# EAGLE design watch_1.2 (EAGLE 9.6.2)
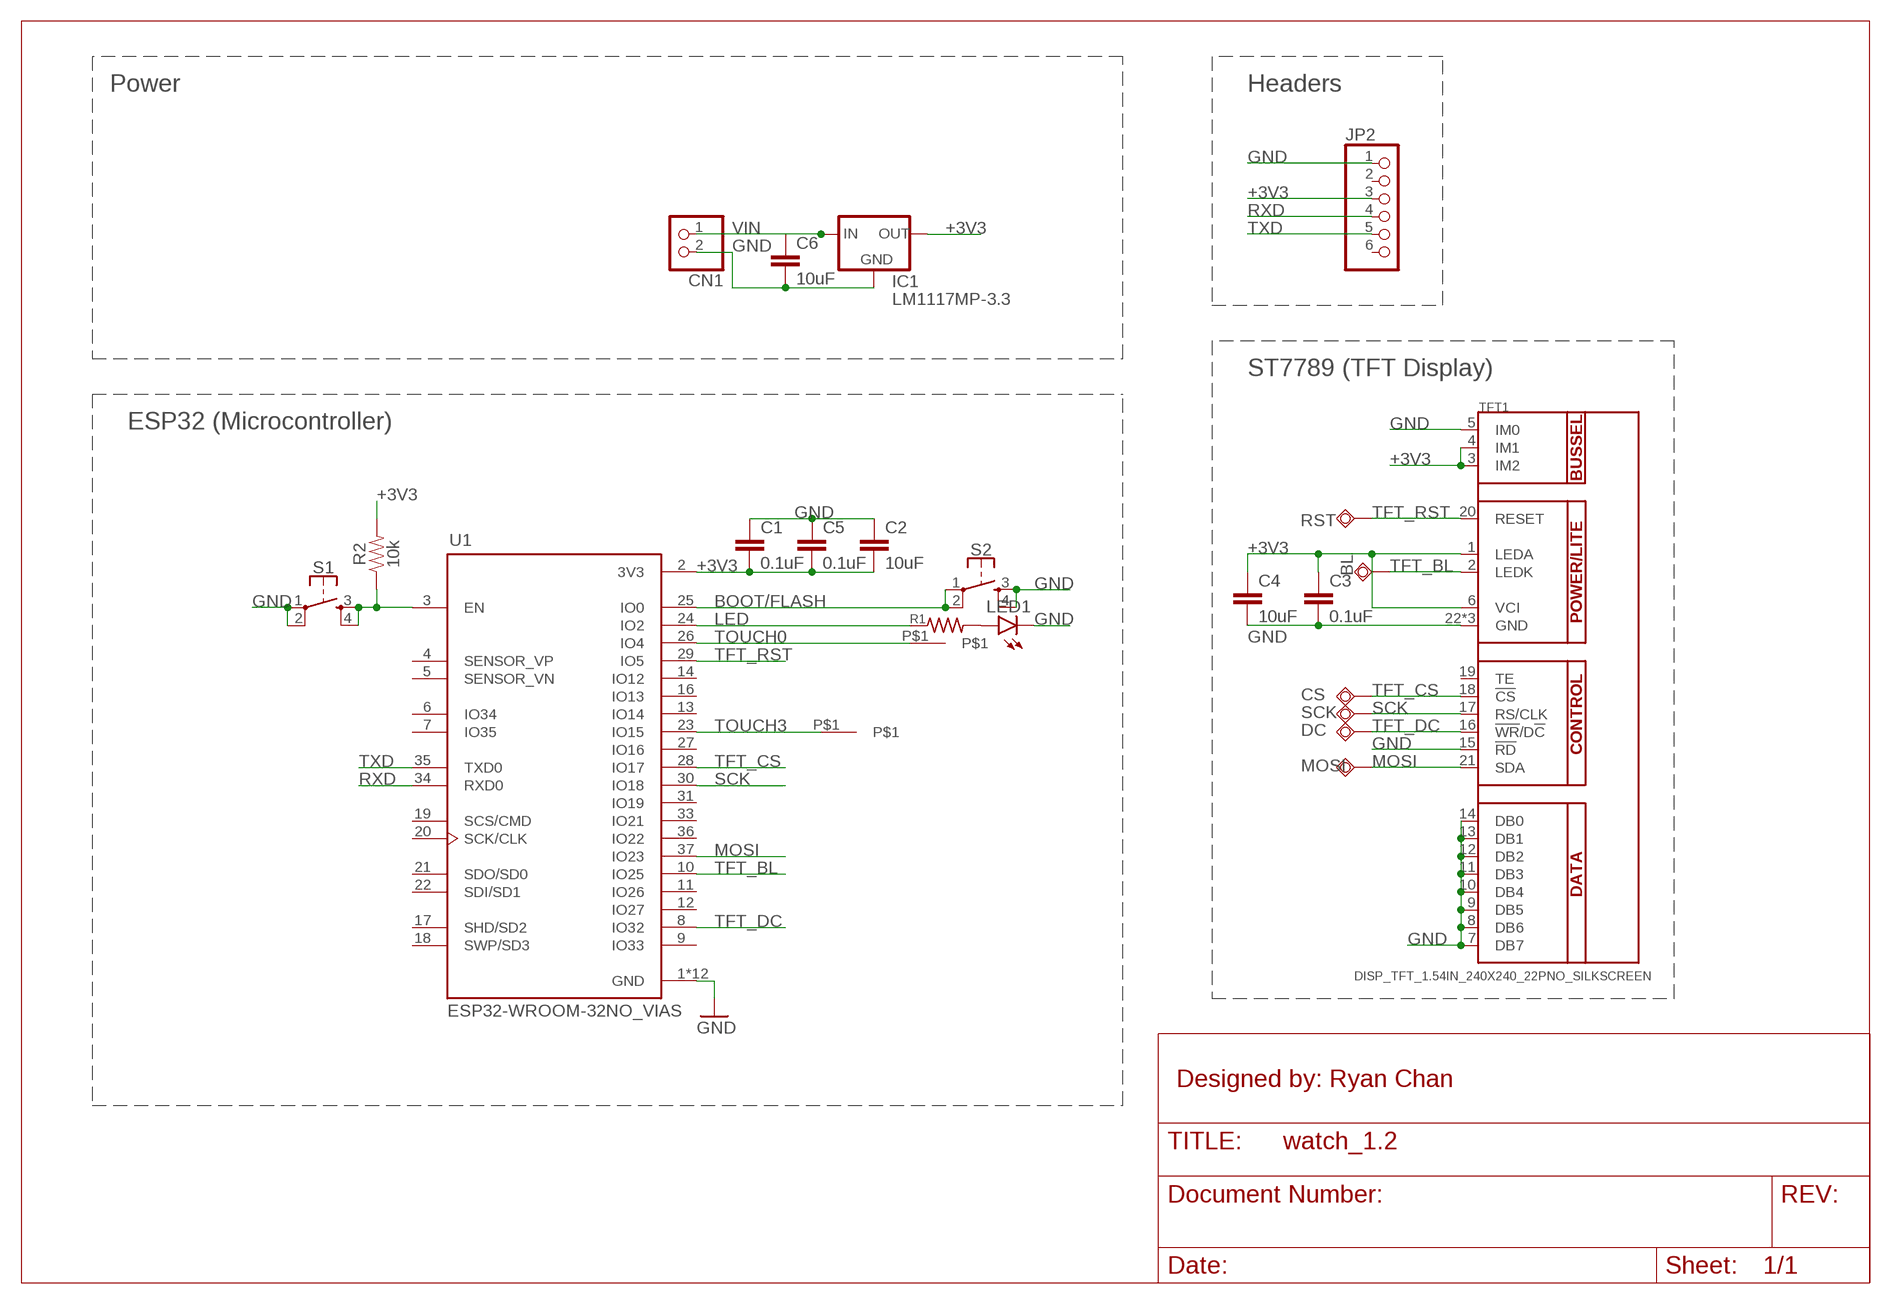
[diagram p0: schematic, sheet 1]

## Parts
BL  TPSQTP20R  [TP20R]
C1  0.1uF  C-EUC0603  [C0603]
C2  10uF  C-EUC0603  [C0603]
C3  0.1uF  C-EUC0603  [C0603]
C4  10uF  C-EUC0603  [C0603]
C5  0.1uF  C-EUC0603  [C0603]
C6  10uF  C-EUC0603  [C0603]
CN1  JST_2PIN-SMT-RA  [JST-PH-2-SMT-RA]
CS  TPSQTP20R  [TP20R]
DC  TPSQTP20R  [TP20R]
IC1  LM1117MP-3.3  [SOT223]
JP2  PINHD-1X6CLEAN  [1X06-CLEAN]
LED1  LEDCHIPLED_0603  [CHIPLED_0603]
MOSI  TPSQTP20R  [TP20R]
R1  R-US_R0603  [R0603]
R2  10k  10KOHM-0603-1/10W-1%  [0603]
RST  TPSQTP20R  [TP20R]
S1  RESET  MOMENTARY-SWITCH-SPST-2-SMD-4.6X2.8MM  [TACTILE_SWITCH_SMD_4.6X2.8MM]
S2  RESET  MOMENTARY-SWITCH-SPST-2-SMD-4.6X2.8MM  [TACTILE_SWITCH_SMD_4.6X2.8MM]
SCK  TPSQTP20R  [TP20R]
TFT1  DISP_TFT_1.54IN_240X240_22PNO_SILKSCREEN  [TFT_1.54IN_240X240_22PIN_NO_SILKSCREEN]
U1  ESP32-WROOM-32NO_VIAS  [MODULE_ESP32-WROOM-32_NO_VIAS]
U$1  CAPACITIVE_PAD_1  [CAPACITIVE_PAD_1]
U$2  CAPACITIVE_PAD_1  [CAPACITIVE_PAD_1]

## Nets
+3V3: C1.2 C2.2 C3.1 C4.1 C5.2 IC1.2(OUT) IC1.4(OUT) JP2.3 R2.2 TFT1.1(LEDA) TFT1.3(IM2) TFT1.4(IM1) TFT1.6(VCI) U1.2(3V3)
BOOT/FLASH: S2.1 S2.2 U1.25(IO0)
CHIP_PU: R2.1 S1.3 S1.4 U1.3(EN)
GND: C1.1 C2.1 C3.2 C4.2 C5.1 C6.2 CN1.2 IC1.1(GND) JP2.1 LED1.C S1.1 S1.2 S2.3 S2.4 TFT1.5(IM0) TFT1.7(DB7) TFT1.8(DB6) TFT1.9(DB5) TFT1.10(DB4) TFT1.11(DB3) TFT1.12(DB2) TFT1.13(DB1) TFT1.14(DB0) TFT1.15(!RD) TFT1.22(GND) TFT1.SUPPORT1(GND) TFT1.SUPPORT2(GND) U1.1(GND) U1.15(GND) U1.38(GND) U1.39_1(GND) U1.39_2(GND) U1.39_3(GND) U1.39_4(GND) U1.39_5(GND) U1.39_6(GND) U1.39_7(GND) U1.39_8(GND) U1.39_9(GND)
LED: R1.1 U1.24(IO2)
MOSI: MOSI.TP TFT1.21(SDA) U1.37(IO23)
N$1: LED1.A R1.2
RXD: JP2.4 U1.34(RXD0)
SCK: SCK.TP TFT1.17(RS/CLK) U1.30(IO18)
TFT_BL: BL.TP TFT1.2(LEDK) U1.10(IO25)
TFT_CS: CS.TP TFT1.18(!CS) U1.28(IO17)
TFT_DC: DC.TP TFT1.16(!WR!/D!C) U1.8(IO32)
TFT_RST: RST.TP TFT1.20(RESET) U1.29(IO5)
TOUCH0: U1.26(IO4) U$2.P$1
TOUCH3: U1.23(IO15) U$1.P$1
TXD: JP2.5 U1.35(TXD0)
VIN: C6.1 CN1.1 IC1.3(IN)
Unconnected: JP2.2 JP2.6 TFT1.19(TE) U1.4(SENSOR_VP) U1.5(SENSOR_VN) U1.6(IO34) U1.7(IO35) U1.9(IO33) U1.11(IO26) U1.12(IO27) U1.13(IO14) U1.14(IO12) U1.16(IO13) U1.17(SHD/SD2) U1.18(SWP/SD3) U1.19(SCS/CMD) U1.20(SCK/CLK) U1.21(SDO/SD0) U1.22(SDI/SD1) U1.27(IO16) U1.31(IO19) U1.33(IO21) U1.36(IO22)

## Notes on the sheet
- Power | Headers
- ST7789 (TFT Display)
- ESP32 (Microcontroller)
- Designed by: Ryan Chan

## Library data of the parts
BL CS DC MOSI RST SCK = testpad:TPSQ: Test pad
C1-C6 = rcl:C-EU: CAPACITOR, European symbol; SPICEPREFIX: C
CN1 = adafruit:JST_2PIN: JST 2-Pin Connectors of various flavors SMT-RA (S2B-PH-SM4) 4UConnector #17311 SMT (B2B-PH-SM4) THM-RA (S2B-PH) THM (B2B-PH)
IC1 = lm1117_10:LM1117?-*: 800mA Low-Dropout Linear Regulator Source: http://www.ti.com/lit/ds/symlink/lm1117-n.pdf; MF: Texas Instruments; MPN: LM1117MP-3.3; OC_FARNELL: 9778195; OC_NEWARK: 28X3416
JP2 = adafruit:PINHD-1X6: PIN HEADER
LED1 = led:LED: LED OSRAM: - CHIPLED LG R971, LG N971, LY N971, LG Q971, LY Q971, LO R971, LY R971 LH N974, LH R974 LS Q976, LO Q976, LY Q976 LO Q996 - Hyper CHIPLED LW Q18S LB Q993, LB Q99A, LB R99A - SideLED LS A670, LO A670, LY A670, LG A670, LP A670 LB A673, LV A673, LT A673, LW A673 LH A674 LY A675 LS A676, LA A676, LO A676, LY A676, LW A676 LS A679, LY A679, LG A679 - Hyper Micro SIDELED® LS Y876, LA Y876, LO Y876, LY Y876 LT Y87S - SmartLED LW L88C, LW L88S LB L89C, LB L89S, LG L890 LS L89K, LO L89K, LY L89K LS L896, LA L896, LO L896, LY L896 - TOPLED LS T670, LO T670, LY T670, LG T670, LP T670 LSG T670, LSP T670, LSY T670, LOP T670, LYG T670 LG T671, LOG T671, LSG T671 LB T673, LV T673, LT T673, LW T673 LH T674 LS T676, LA T676, LO T676, LY T676, LB T676, LH T676, LSB T676, LW T676 LB T67C, LV T67C, LT T67C, LS T67K, LO T67K, LY T67K, LW E67C LS E67B, LA E67B, LO E67B, LY E67B, LB E67C, LV E67C, LT E67C LW T67C LS T679, LY T679, LG T679 LS T770, LO T770, LY T770, LG T770, LP T770 LB T773, LV T773, LT T773, LW T773 LH T774 LS E675, LA E675, LY E675, LS T675 LS T776, LA T776, LO T776, LY T776, LB T776 LHGB T686 LT T68C, LB T68C - Hyper Mini TOPLED® LB M676 - Mini TOPLED Santana® LG M470 LS M47K, LO M47K, LY M47K Source: http://www.osram.convergy.de LUXEON: - LUMILED® LXK2-PW12-R00, LXK2-PW12-S00, LXK2-PW14-U00, LXK2-PW14-V00 LXK2-PM12-R00, LXK2-PM12-S00, LXK2-PM14-U00 LXK2-PE12-Q00, LXK2-PE12-R00, LXK2-PE12-S00, LXK2-PE14-T00, LXK2-PE14-U00 LXK2-PB12-K00, LXK2-PB12-L00, LXK2-PB12-M00, LXK2-PB14-N00, LXK2-PB14-P00, LXK2-PB14-Q00 LXK2-PR12-L00, LXK2-PR12-M00, LXK2-PR14-Q00, LXK2-PR14-R00 LXK2-PD12-Q00, LXK2-PD12-R00, LXK2-PD12-S00 LXK2-PH12-R00, LXK2-PH12-S00 LXK2-PL12-P00, LXK2-PL12-Q00, LXK2-PL12-R00 Source: www.luxeon.com KINGBRIGHT: KA-3528ASYC Source: www.kingbright.com
R1 = rcl:R-US_: RESISTOR, American symbol; SPICEPREFIX: R
R2 = SparkFun-Resistors:10KOHM: 10kΩ resistor A resistor is a passive two-terminal electrical component that implements electrical resistance as a circuit element. Resistors act to reduce current flow, and, at the same time, act to lower voltage levels within circuits. - Wikipedia; PROD_ID: RES-00824
S1 S2 = SparkFun-Switches:MOMENTARY-SWITCH-SPST-2: Momentary Switch (Pushbutton) - SPST - Two Circuits Normally-open (NO) SPST momentary switches (buttons, pushbuttons). Schematic symbol includes two switch circuits. Variants SMD-4.6MMX2.8MM - 4.60mm x 2.80mm Tactile Momentary Button Switch - Used on SparkFun SAMD21 Mini Breakout <https://www.sparkfun.com/products/13664> SMD-5.2MM - Mini Pushbutton Switch - SMD <https://www.sparkfun.com/products/8720> - Used on Arduino Pro Mini <https://www.sparkfun.com/products/11114>; PROD_ID: SWCH-13065
TFT1 = a_personal:DISP_TFT_1.54IN_240X240_22P
U1 = ESP32-WROOM-32:ESP32-WROOM-32: Bluetooth, WiFi Transceiver Module 2.4GHz ~ 2.5GHz Surface Mount Check prices <https://pricing.snapeda.com/parts/ESP32-WROOM-32/Espressif%20Systems/view-part?ref=eda>
U$1 U$2 = a_personal:CAPACITIVE_PAD_1

## Board
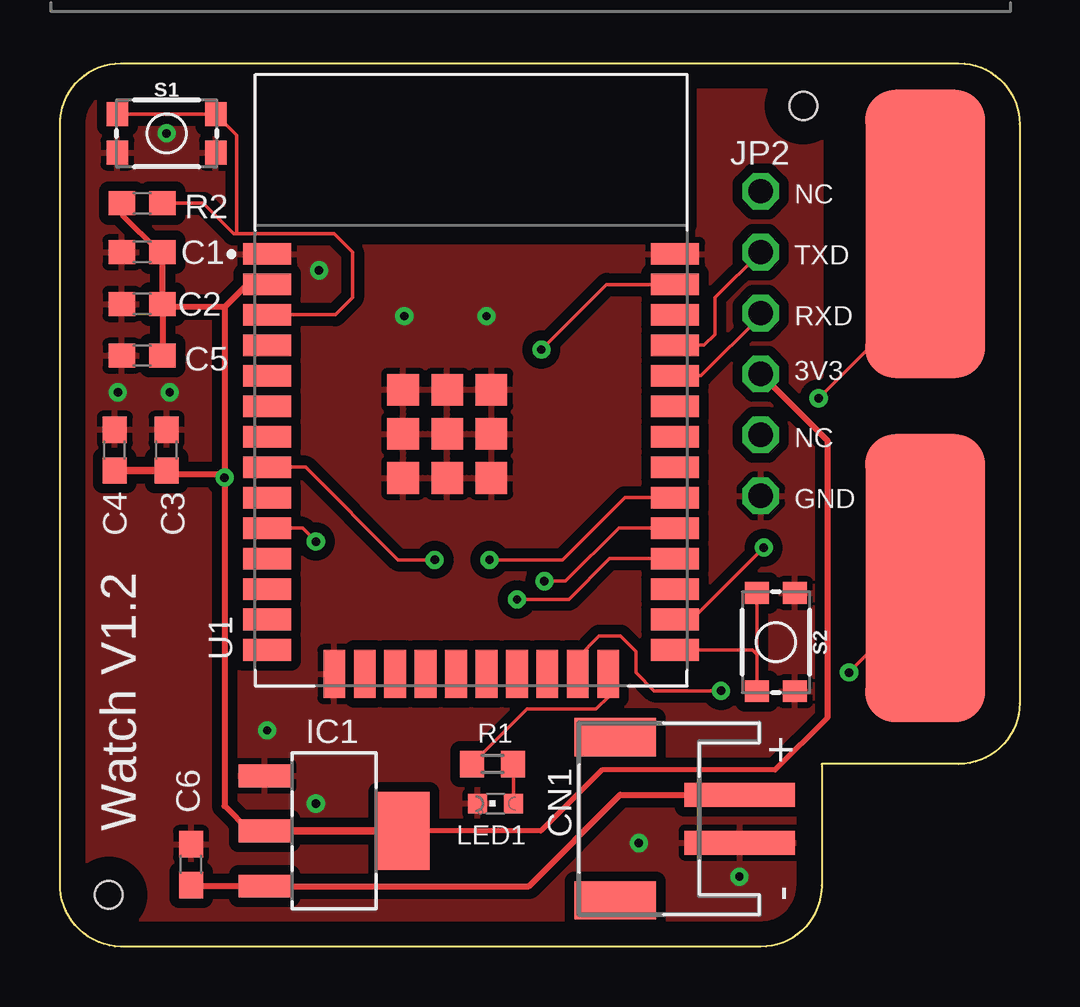
[diagram p1: board, top side]
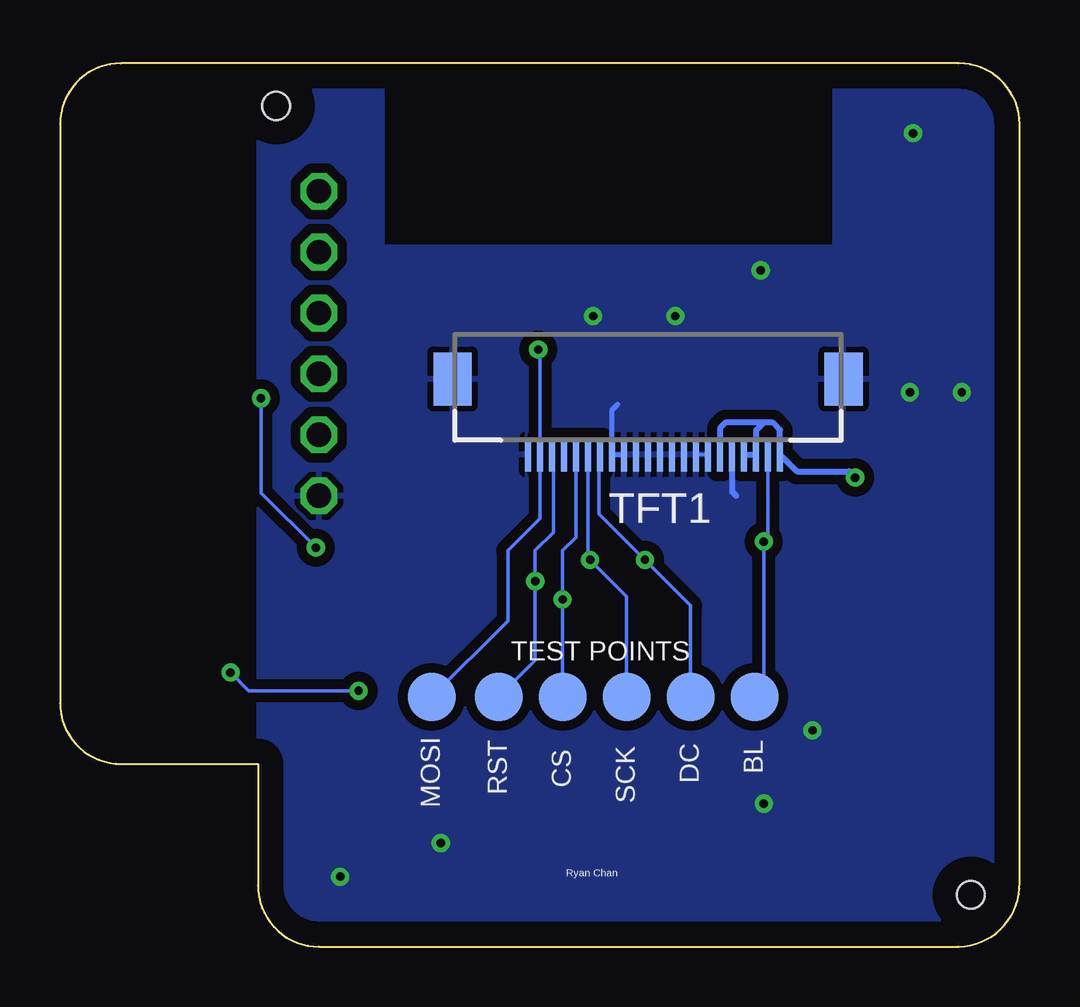
[diagram p2: board, bottom side, seen from below]

Size 40.01 x 36.83 mm. Coordinates in mm from the lower left corner, seen from the top.
Outline: 31.75,7.62 31.75,2.54 arc-90 29.21,0 2.54,0 arc-90 0,2.67 0,34.29 arc-90 2.54,36.83 37.47,36.83 arc-90 40.01,34.29 40.01,10.16 arc-90 37.47,7.62 31.75,7.62
Copper layers (1*16): Top 0.035mm / dielectric 1.5mm / Bottom 0.035mm
Design rules "default": minimum track width 6mil, minimum drill 0.35mm, track to track 6mil, track to pad 6mil, pad to pad 6mil, via to via 6mil, smd to smd 6mil, copper to edge 40mil, drill to drill 6mil, minimum pad ring 10mil, minimum via ring 8mil, stop-mask expansion 4mil, vias tented up to drill 0mil, thermal gap 10mil
Holes 1.16 mm at 2.03,2.16 30.99,35.05

### Footprints (pad centres in the part's own frame; a part is rotated, then mirrored left to right if it is on the bottom)
TP20R = smd 2 x 2: TP 0,0
C0603 = smd 1.1 x 1: 1 -0.85,0; 2 0.85,0
JST-PH-2-SMT-RA = smd 1 x 4.6: 1 1,-3.7; 2 -1,-3.7 | smd 1.6 x 3.4: NC1 -3.4,1.5; NC2 3.4,1.5
SOT223 = smd 0.95 x 2.15: 1 -2.3,-2.9; 2 0,-2.9; 3 2.3,-2.9 | smd 3.25 x 2.15: 4 0,2.9
1X06-CLEAN = drill 1.016 octagon: 1 -6.35,0; 2 -3.81,0; 3 -1.27,0; 4 1.27,0; 5 3.81,0; 6 6.35,0
CHIPLED_0603 = smd 0.8 x 0.8: A 0,-0.75; C 0,0.75
R0603 = smd 1 x 1.1: 1 -0.85,0; 2 0.85,0
0603 = smd 1.1 x 1: 1 -0.85,0; 2 0.85,0
TACTILE_SWITCH_SMD_4.6X2.8MM = smd 0.9 x 1: 1 -2.05,-0.8; 2 2.05,-0.8; 3 2.05,0.8; 4 -2.05,0.8
TFT_1.54IN_240X240_22PIN_NO_SILKSCREEN = smd 0.25 x 1.4 bottom: 1 5.25,2.722; 2 4.75,2.722; 3 4.25,2.722; 4 3.75,2.722; 5 3.25,2.722; 6 2.75,2.722; 7 2.25,2.722; 8 1.75,2.722; 9 1.25,2.722; 10 0.75,2.722; 11 0.25,2.722; 12 -0.25,2.722; 13 -0.75,2.722; 14 -1.25,2.722; 15 -1.75,2.722; 16 -2.25,2.722; 17 -2.75,2.722; 18 -3.25,2.722; 19 -3.75,2.722; 20 -4.25,2.722; 21 -4.75,2.722; 22 -5.25,2.722 | smd 1.6 x 2.2 bottom: SUPPORT1 7.9,-0.428; SUPPORT2 -8.4,-0.428
MODULE_ESP32-WROOM-32_NO_VIAS = smd 2 x 0.9: 1 -8.5,5.26; 2 -8.5,3.99; 3 -8.5,2.72; 4 -8.5,1.45; 5 -8.5,0.18; 6 -8.5,-1.09; 7 -8.5,-2.36; 8 -8.5,-3.63; 9 -8.5,-4.9; 10 -8.5,-6.17; 11 -8.5,-7.44; 12 -8.5,-8.71; 13 -8.5,-9.98; 14 -8.5,-11.25; 25 8.5,-11.25; 26 8.5,-9.98; 27 8.5,-8.71; 28 8.5,-7.44; 29 8.5,-6.17; 30 8.5,-4.9; 31 8.5,-3.63; 32 8.5,-2.36; 33 8.5,-1.09; 34 8.5,0.18; 35 8.5,1.45; 36 8.5,2.72; 37 8.5,3.99; 38 8.5,5.26 | smd 0.9 x 2: 15 -5.715,-12.25; 16 -4.445,-12.25; 17 -3.175,-12.25; 18 -1.905,-12.25; 19 -0.635,-12.25; 20 0.635,-12.25; 21 1.905,-12.25; 22 3.175,-12.25; 23 4.445,-12.25; 24 5.715,-12.25 | smd 1.33 x 1.33: 39_1 -2.835,-0.405; 39_2 -1,-0.405; 39_3 0.835,-0.405; 39_4 -2.835,-2.24; 39_5 -1,-2.24; 39_6 0.835,-2.24; 39_7 -2.835,-4.075; 39_8 -1,-4.075; 39_9 0.835,-4.075
CAPACITIVE_PAD_1 = smd 5 x 12: P$1 0,0

### Placement (x,y rotation side)
BL  11.05,10.41 0 bottom
C1  3.43,28.96 0 top
C2  3.43,26.8 0 top
C3  4.45,20.7 90 top
C4  2.29,20.7 90 top
C5  3.43,24.64 0 top
C6  5.46,3.43 90 top
CN1  24.64,5.33 90 top
CS  19.05,10.41 0 bottom
DC  13.72,10.41 0 bottom
IC1  11.43,4.83 270 top
JP2  29.21,25.15 90 top
LED1  18.16,5.97 90 top
MOSI  24.51,10.41 0 bottom
R1  18.03,7.62 0 top
R2  3.43,30.99 180 top
RST  21.72,10.41 0 bottom
S1  4.45,33.91 0 top
S2  29.84,12.7 270 top
SCK  16.38,10.41 0 bottom
TFT1  15.24,23.24 180 top
U1  17.14,23.62 0 top
U$1  36.07,15.37 0 top
U$2  36.07,29.72 0 top

### Tracks (layer width: path | path; a pad name or v marks a point on that pad's centre or on a via)
+3V3  (via drill 0.35)
  Top 0.152: C1.2 4.15,28.96 4.11,29
  Top 0.203: 32,9.56 29.81,7.37 22.59,7.37 20.05,4.83 IC1.4 | R2.2 2.58,30.53 4.11,29 4.28,28.83
  Top 0.254: v6.86,19.56 6.86,19.69 4.61,19.69 C3.1 | IC1.2 7.89,4.83 6.86,5.86 v6.86,19.56 | JP2.3 32,21.08 32,9.56 | U1.2 7.8,27.61 6.86,26.67 | 6.86,26.67 v6.86,19.56 | 6.86,26.67 4.41,26.67 C2.2 | C2.2 4.28,28.83 C1.2 | C2.2 C5.2
  Top 0.305: C3.1 C4.1 | IC1.2 IC1.4
  Bottom 0.254: TFT1.4 TFT1.3 10.99,21.52 10.67,21.84 | TFT1.6 12.49,21.62 12.27,21.84 10.67,21.84 | 10.67,21.84 10.29,21.84 9.99,21.55 TFT1.1 9.28,19.81 7.11,19.81 v6.86,19.56
BOOT/FLASH
  Top 0.152: S2.2 29.05,12.19 | 29.05,12.19 S2.1 | 29.05,12.19 28.86,12.37 U1.25
CHIP_PU
  Top 0.152: R2.1 5.97,30.99 7.24,29.72 7.37,29.72 | 7.37,29.72 7.37,33.84 S1.3 S1.4 | U1.3 11.48,26.34 12.19,27.05 12.19,28.96 11.43,29.72 7.37,29.72
GND  (via drill 0.35)
  Bottom 0.152: TFT1.7 TFT1.8
  Bottom 0.203: TFT1.14 TFT1.15 16.99,22.38 16.76,22.61
  Bottom 0.254: TFT1.5 11.99,18.98 11.81,18.8
  other vias: 17.78,26.29 14.35,26.29 2.41,23.11 8.64,9.02 4.45,33.91 4.57,23.11 24.13,4.32 10.67,5.97 10.79,28.19 28.32,2.92
  pour Top (isolate 0.406): -0.64,-2.54 -0.64,36.83 7.75,36.83 7.75,29.21 26.54,29.21 26.54,36.83 31.75,36.83 31.75,-2.54
  pour Bottom (isolate 0.406): -0.64,-2.54 -0.64,36.83 7.75,36.83 7.75,29.21 26.54,29.21 26.54,36.83 31.75,36.83 31.75,-2.54
LED
  Top 0.152: U1.24 22.86,10.41 22.35,9.91 19.47,9.91 R1.1
MOSI  (via drill 0.35)
  Top 0.152: v20.07,24.89 22.79,27.61 U1.37
  Bottom 0.152: v20.07,24.89 19.99,24.82 TFT1.21 19.99,17.86 21.34,16.51 21.34,13.59 MOSI.TP
N$1
  Top 0.152: R1.2 18.91,7.59 LED1.A
RXD
  Top 0.152: U1.34 25.91,23.8 26.6,23.8 26.72,23.8 29.21,26.29 JP2.4
SCK  (via drill 0.35)
  Top 0.152: v17.91,16.13 20.95,16.13 23.55,18.72 U1.30
  Bottom 0.152: TFT1.17 17.99,16.21 v17.91,16.13 16.38,14.61 SCK.TP
TFT_BL  (via drill 0.35)
  Top 0.152: U1.10 10.11,17.45 v10.67,16.89
  Bottom 0.152: TFT1.2 10.49,17.07 v10.67,16.89 10.67,10.8 BL.TP
TFT_CS  (via drill 0.35)
  Top 0.152: v19.05,14.48 21.21,14.48 22.91,16.18 U1.28
  Bottom 0.152: TFT1.18 18.49,17.07 19.05,16.51 v19.05,14.48 CS.TP
TFT_DC  (via drill 0.35)
  Top 0.152: v15.62,16.13 14.1,16.13 10.23,19.99 U1.8
  Bottom 0.152: TFT1.16 17.53,20.48 17.53,18.03 v15.62,16.13 13.72,14.22 DC.TP
TFT_RST  (via drill 0.35)
  Top 0.152: v20.19,15.24 21.08,15.24 23.29,17.45 U1.29
  Bottom 0.152: TFT1.20 19.43,20.46 19.43,17.27 20.19,16.51 v20.19,15.24 20.19,11.94 RST.TP
TOUCH0  (via drill 0.35)
  Top 0.152: v31.62,22.86 36.07,27.3 U$2.P$1 | v29.34,16.64 26.34,13.64 U1.26
  Bottom 0.152: v29.34,16.64 31.62,18.92 v31.62,22.86
TOUCH3  (via drill 0.35)
  Top 0.152: U1.23 21.59,12.07 22.48,12.95 23.37,12.95 24,12.32 24,11.43 24.77,10.67 v27.56,10.67 | v32.89,11.43 36.07,14.61 U$1.P$1
  Bottom 0.152: v27.56,10.67 32.13,10.67 v32.89,11.43
TXD
  Top 0.152: U1.35 26.85,25.07 27.3,25.53 27.3,27.05 JP2.5
VIN
  Top 0.254: CN1.1 23.35,6.33 19.54,2.53 IC1.3 5.51,2.53 C6.1

### Text on the board
tPlace: NC | TXD | RXD | 3V3 | NC | GND | Watch V1.2
bPlace: TFT1 | TEST POINTS | Ryan Chan